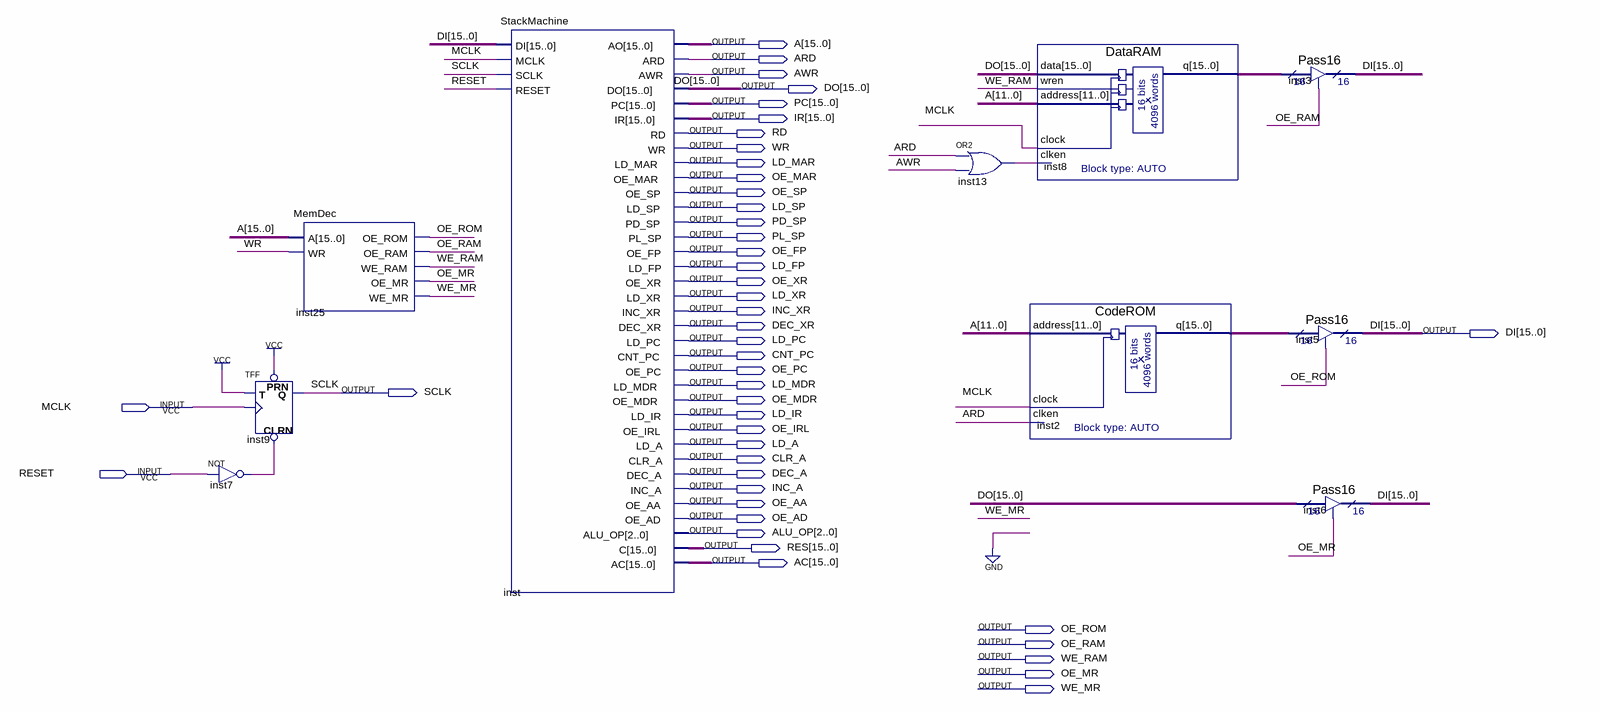
[diagram p0: schematic sheet]
// Quartus schematic StackMachine_sim.bdf as structural Verilog: 10 symbols, 45 pins
module StackMachine_sim (
  input  MCLK,
  input  RESET,
  output [15:0] A,
  output ARD,
  output AWR,
  output [15:0] DO,
  output [15:0] PC,
  output [15:0] IR,
  output RD,
  output WR,
  output LD_MAR,
  output OE_MAR,
  output OE_SP,
  output LD_SP,
  output PD_SP,
  output PL_SP,
  output OE_FP,
  output LD_FP,
  output OE_XR,
  output LD_XR,
  output INC_XR,
  output DEC_XR,
  output [15:0] DI,
  output LD_PC,
  output CNT_PC,
  output OE_PC,
  output LD_MDR,
  output SCLK,
  output OE_MDR,
  output LD_IR,
  output OE_IRL,
  output LD_A,
  output CLR_A,
  output DEC_A,
  output INC_A,
  output OE_AA,
  output OE_AD,
  output [2:0] ALU_OP,
  output [15:0] RES,
  output [15:0] AC,
  output OE_ROM,
  output OE_RAM,
  output WE_RAM,
  output OE_MR,
  output WE_MR
);

  wire inst7_out, inst13_out;
  wire [15:0] inst2_q, inst8_q;

  TFF inst9 (.PRN(1'b1), .CLRN(inst7_out), .T(1'b1), .CLK(MCLK), .Q(SCLK));
  not inst7 (inst7_out, RESET);
  MemDec inst25 (.A(A), .WR(WR), .OE_ROM(OE_ROM), .OE_RAM(OE_RAM), .WE_RAM(WE_RAM), .OE_MR(OE_MR), .WE_MR(WE_MR));
  StackMachine inst (
    .DI(DI), .MCLK(MCLK), .SCLK(SCLK), .RESET(RESET), .AO(A), .ARD(ARD), .AWR(AWR), .DO(DO), .PC(PC),
    .IR(IR), .RD(RD), .WR(WR), .LD_MAR(LD_MAR), .OE_MAR(OE_MAR), .OE_SP(OE_SP), .LD_SP(LD_SP), .PD_SP(PD_SP),
    .PL_SP(PL_SP), .OE_FP(OE_FP), .LD_FP(LD_FP), .OE_XR(OE_XR), .LD_XR(LD_XR), .INC_XR(INC_XR),
    .DEC_XR(DEC_XR), .LD_PC(LD_PC), .CNT_PC(CNT_PC), .OE_PC(OE_PC), .LD_MDR(LD_MDR), .OE_MDR(OE_MDR),
    .LD_IR(LD_IR), .OE_IRL(OE_IRL), .LD_A(LD_A), .CLR_A(CLR_A), .DEC_A(DEC_A), .INC_A(INC_A), .OE_AA(OE_AA),
    .OE_AD(OE_AD), .ALU_OP(ALU_OP), .C(RES), .AC(AC));
  or inst13 (inst13_out, ARD, AWR);
  DataRAM inst8 (.data(DO), .wren(WE_RAM), .address(A[11:0]), .clock(MCLK), .clken(inst13_out), .q(inst8_q));
  CodeROM inst2 (.address(A[11:0]), .clock(MCLK), .clken(ARD), .q(inst2_q));
  Pass16 inst3 (.enabledt(OE_RAM), .data(inst8_q), .tridata(DI));
  Pass16 inst5 (.enabledt(OE_ROM), .data(inst2_q), .tridata(DI));
  Pass16 inst6 (.enabledt(OE_MR), .data(DO), .tridata(DI));
endmodule
